# Altium project USBASP.PrjPcb
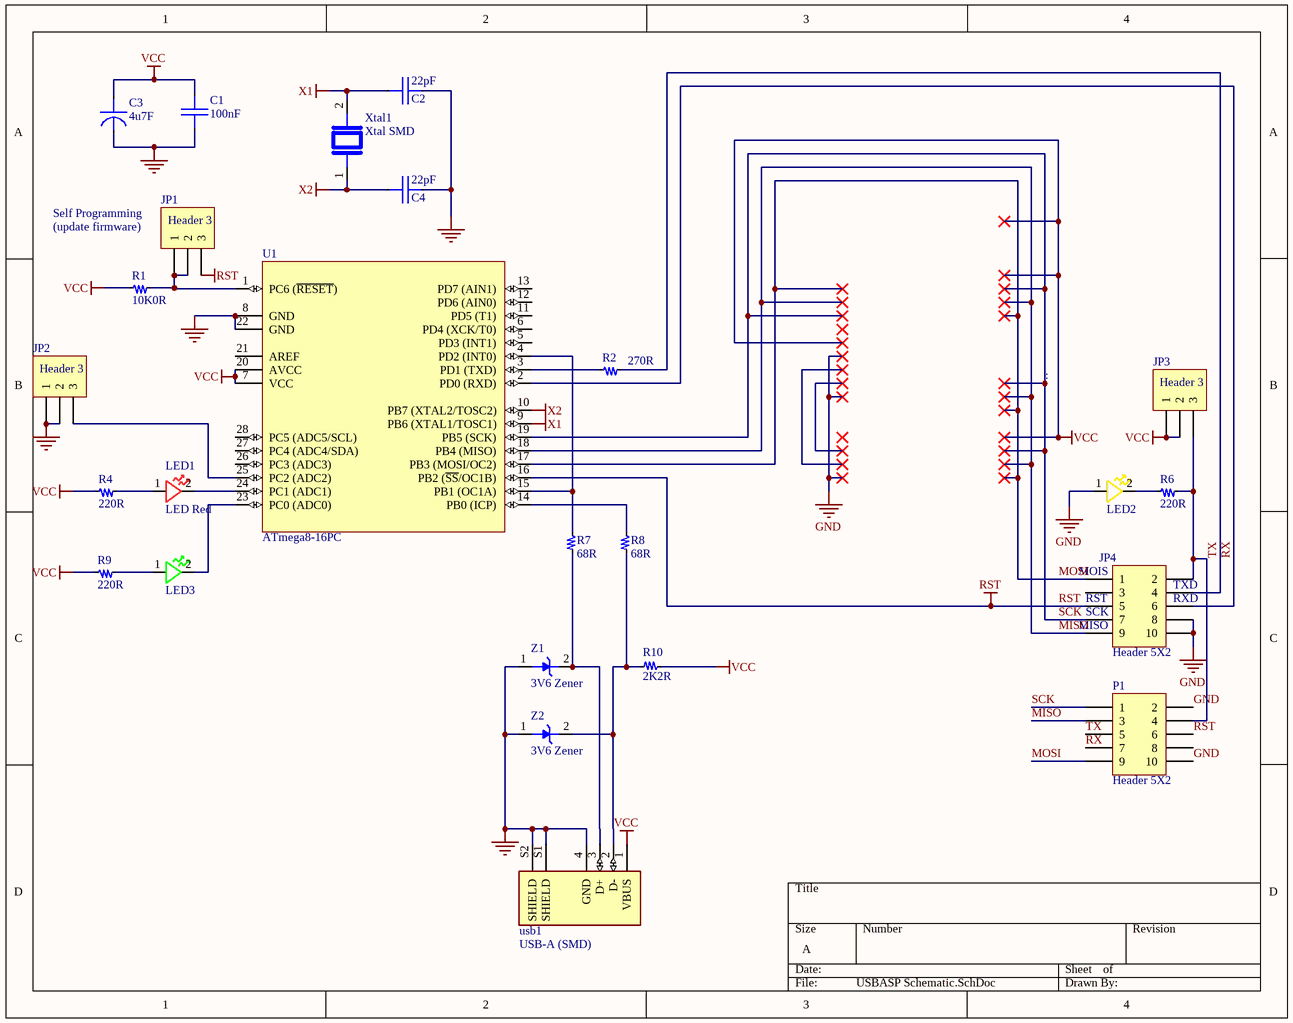
[diagram p0: USBASP Schematic.SchDoc]
1 sheet, 25 parts. Net scope: global (net labels, ports and power ports of the same name join across sheets).
Board file: USBASP PCB.PcbDoc

## Sheet USBASP Schematic.SchDoc
size A; SheetNumber: 1; SheetTotal: 1

### Parts
C1  100nF  [SMD_0805]
C2  22pF  [SMD_0805]
C3  4u7F  [Core C (6.3X5.4)]
C4  22pF  [SMD_0805]
JP1  Header 3  [HDR1X3]
JP2  Header 3  [HDR1X3]
JP3  Header 3  [HDR1X3]
JP4  Header 5X2  [HDR2X5]
LED1  LED Red  [LED 0805 RED]
LED2  LED Yellow  [LED 0805 YELLOW]  (value not drawn)
LED3  LED Green  [LED 0805 GREEN]  (value not drawn)
P1  Header 5X2  [HDR2X5]
R1  10K0R  [0805]
R2  270R  [0805]
R4  220R  [0805]
R6  220R  [0805]
R7  68R  [0805]
R8  68R  [0805]
R9  220R  [0805]
R10  2K2R  [0805]
U1  ATmega8-16PC  [AT MEGA 8]
usb1  USB-A (SMD)  [USB-A (SMD)]
Xtal1  Xtal SMD  [Xtal]
Z1  3V6 Zener  [Zener _ mini melf]
Z2  3V6 Zener  [Zener _ mini melf]

### Nets
GND: C1.1 C2.2 C3.- C4.2 JP2.1 JP2.2 JP4.8 JP4.10 LED2.1 P1.2 P1.10 U1.8(GND) U1.22(GND) usb1.4(GND) usb1.S1(SHIELD) usb1.S2(SHIELD) Z1.1 Z2.1
RST: JP1.3 JP4.5 P1.6 U1.16(PB2_(~{SS}/OC1B))
VCC: C1.2 C3.+ JP3.1 JP3.2 R1.2 R4.2 R9.2 R10.2 U1.7(VCC) U1.20(AVCC) usb1.1(VBUS)
X1: C2.1 U1.9(PB6_(XTAL1/TOSC1)) Xtal1.2
X2: C4.1 U1.10(PB7_(XTAL2/TOSC2)) Xtal1.1
MISO: JP4.9 P1.3 U1.18(PB4_(MISO))
MOSI: JP4.1 P1.9 U1.17(PB3_(MOSI/OC2))
RX: JP4.6 P1.7 U1.2(PD0_(RXD))
SCK: JP4.7 P1.1 U1.19(PB5_(SCK))
TX: JP4.4 P1.5 R2.1
NetJP1_1: JP1.1 JP1.2 R1.1 U1.1(PC6_(~{RESET}))
NetJP2_3: JP2.3 U1.25(PC2_(ADC2))
NetJP3_3: JP3.3 JP4.2 P1.4 R6.1
NetLED1_1: LED1.1 R4.1
NetLED1_2: LED1.2 U1.24(PC1_(ADC1))
NetLED2_2: LED2.2 R6.2
NetLED3_1: LED3.1 R9.1
NetLED3_2: LED3.2 U1.23(PC0_(ADC0))
NetR2_2: R2.2 U1.3(PD1_(TXD))
NetR7_1: R7.1 usb1.3(D+) Z1.2
NetR7_2: R7.2 U1.4(PD2_(INT0)) U1.15(PB1_(OC1A))
NetR8_1: R8.1 R10.1 usb1.2(D-) Z2.2
NetR8_2: R8.2 U1.14(PB0_(ICP))

Not connected (* = marked no-connect by the designer): JP4 3; P1 8; U1 5(PD3_(INT1)) 6(PD4_(XCK/T0)) 11(PD5_(T1)) 12(PD6_(AIN0)) 13(PD7_(AIN1)) 21(AREF) 26(PC3_(ADC3)) 27(PC4_(ADC4/SDA)) 28(PC5_(ADC5/SCL))

### Notes on the sheet
- (in symbol Header 3) Self Programming; (update firmware)
- (in symbol Header 5X2) MOIS; TXD; RST; RXD; SCK; MISO

### Library data of the parts
C1 C2 C4 = SMD CAP
C3 = Electrolit CAP
JP1-JP3 = Header 3: Header, 3-Pin; Revision: 17-Jul-2002: Re-released for DXP Platform.; Publisher: Altium Limited
JP4 P1 = Header 5X2: Header, 5-Pin, Dual row; Publisher: Altium Limited
  JP4: Revision: 17-Jul-2002: Re-released for DXP Platform.
  P1: LatestRevisionDate: 17-Jul-2002; LatestRevisionNote: Re-released for DXP Platform.
R1 R2 R4 R6-R10 = SMD
U1 = ATmega8-16PC: 8-Bit AVR Microcontroller with 8K Bytes of In-System Programmable Flash Memory; Package Information: Latest Revision: revB, Sep-2001; Published: 17-Sep-2003; Datasheet: Latest Revision: 2486H-AVR-09/02; Package Reference: 28P3; Publisher: Altium Limited
Xtal1 = Xtal
Z1 Z2 = Zener